# Altium schematic sheet PCB加热台3.0 copy_2022-02-18.schdoc
size 604 x 430 mm
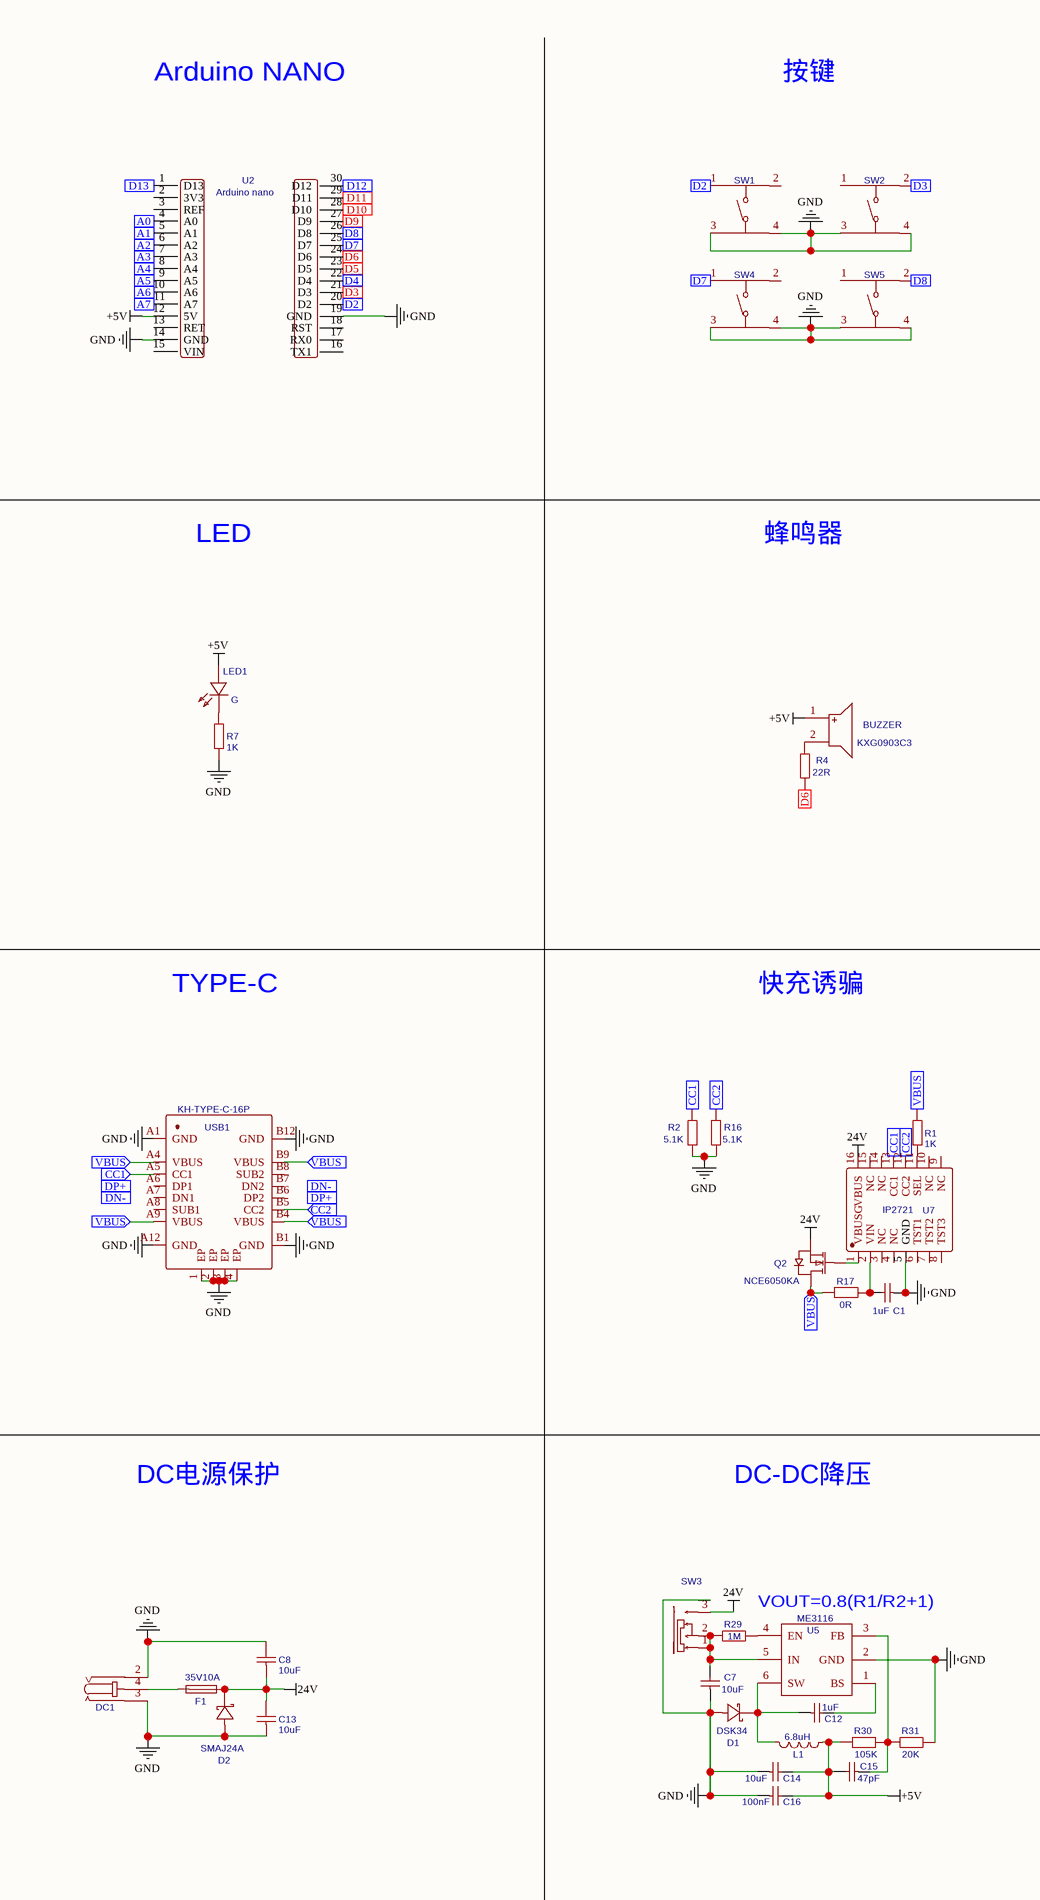
[diagram p0: PCB加热台3.0 copy_2022-02-18.schdoc, left]
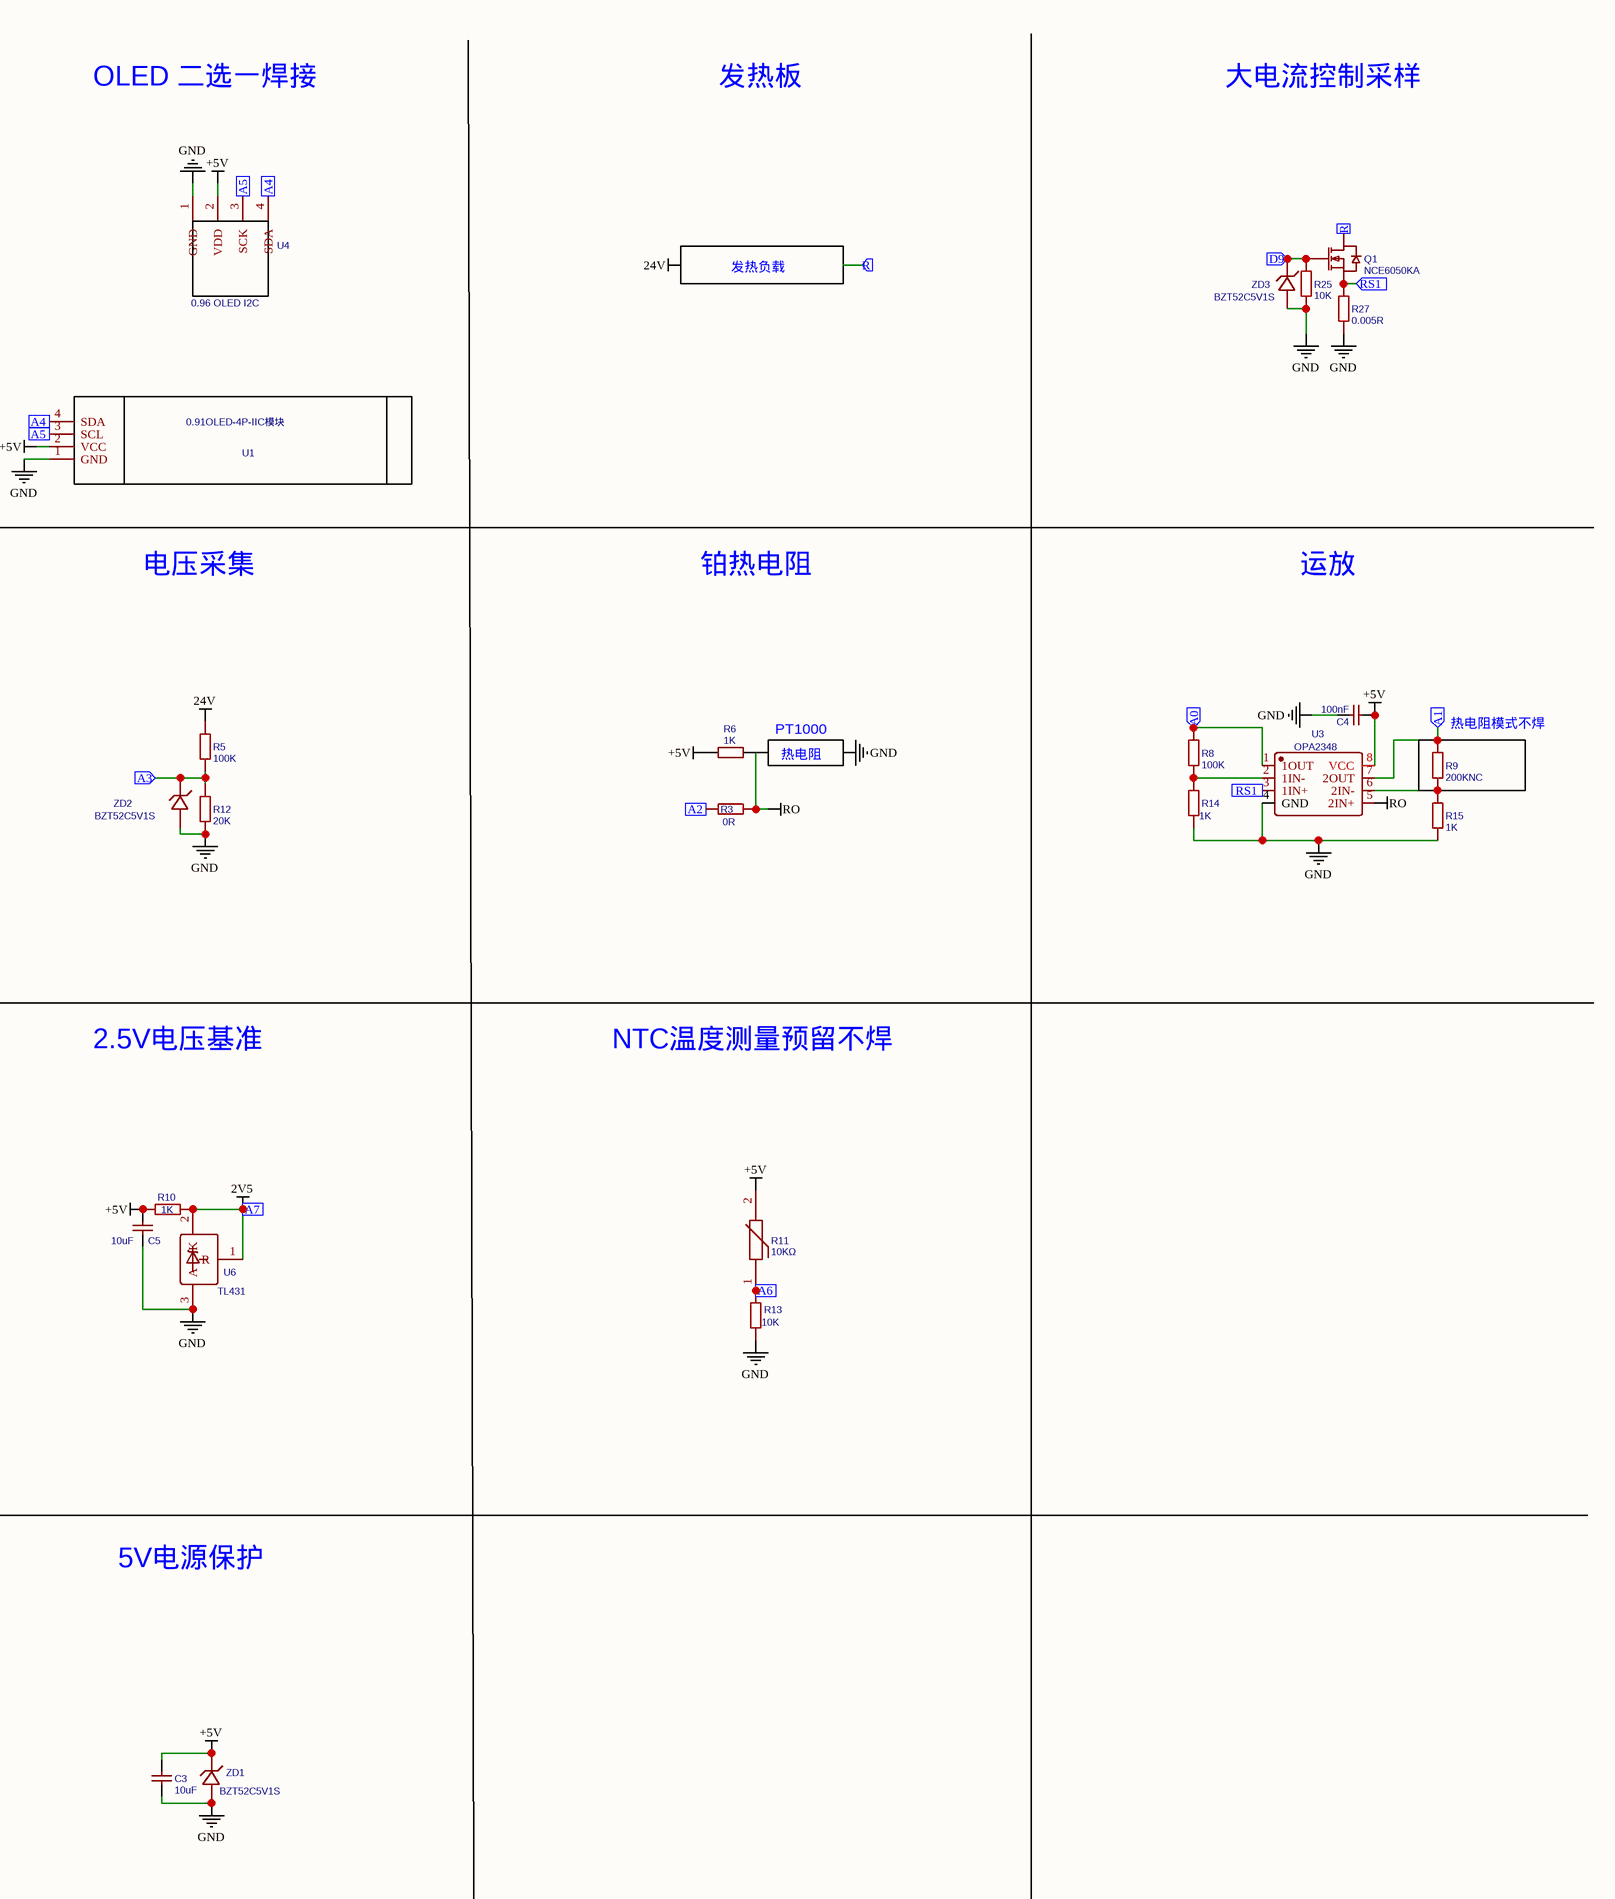
[diagram p1: PCB加热台3.0 copy_2022-02-18.schdoc, right]

## Parts
BUZZER  KXG0903C3  [BUZ-TH_BD9.6-P5.00-D0.7-FD]
C1  1uF  [C0603]
C3  10uF  [C0603]
C4  100nF  [C0603]
C5  10uF  [C0603]
C7  10uF  [C0603]
C8  10uF  [C1206]
C12  1uF  [C0603]
C13  10uF  [C1206]
C14  10uF  [C0603]
C15  47pF  [C0603]
C16  100nF  [C0603]
D1  DSK34  [SOD-123_L2.8-W1.8-LS3.7-RD]
D2  SMAJ24A  [SMA_L4.4-W2.8-LS5.4-R-RD]
DC1  DC-042C-W-2.0  [DC-IN-TH_DC-042C-W-2.0]  (value not drawn)
F1  35V10A  [F1206]
L1  6.8uH  [IND-SMD_L7.1-W6.6_YXMAA0603]
LED1  G  [LED0603-R-RD]
Q1  NCE6050KA  [TO-252-2_L6.6-W6.1-P4.57-LS9.9-TL-CW]
Q2  NCE6050KA  [TO-252-2_L6.6-W6.1-P4.57-LS9.9-TL-CW]
R1  1K  [R0603]
R2  5.1K  [R0603]
R3  0R  [R0603]
R4  22R  [R0603]
R5  100K  [R0603]
R6  1K  [R0805]
R7  1K  [R0603]
R8  100K  [R0603]
R9  200KNC  [R0603]
R10  1K  [R0603]
R11  10KΩ  [R0603]
R12  20K  [R0603]
R13  10K  [R0603]
R14  1K  [R0603]
R15  1K  [R0603]
R16  5.1K  [R0603]
R17  0R  [R0603]
R25  10K  [R0603]
R27  0.005R  [R1206]
R29  1M  [R0603]
R30  105K  [R0603]
R31  20K  [R0603]
SW1  PTS645SM43SMTR92LFS  [KEY-SMD_4P-L6.0-W6.0-P4.50-LS9.0]  (value not drawn)
SW2  PTS645SM43SMTR92LFS  [KEY-SMD_4P-L6.0-W6.0-P4.50-LS9.0]  (value not drawn)
SW3  MSS3-Q-T/R  [SW-SMD_MSS3-Q-T-R]  (value not drawn)
SW4  PTS645SM43SMTR92LFS  [KEY-SMD_4P-L6.0-W6.0-P4.50-LS9.0]  (value not drawn)
SW5  PTS645SM43SMTR92LFS  [KEY-SMD_4P-L6.0-W6.0-P4.50-LS9.0]  (value not drawn)
U1  0.91OLED-4P-IIC模块  [OLED-0.91-2.54*4P-IIC]
U2  Arduino nano  [ARDUINO NANO]
U3  OPA2348  [SOP-8_L5.0-W4.0-P1.27-LS6.0-BL]
U4  0.96 OLED I2C  [0.96 OLED I2C]
U5  ME3116  [SOT-23-6_L2.9-W1.6-P0.95-LS2.8-BR]
U6  TL431  [SOT-23-3_L2.9-W1.6-P1.90-LS2.8-BR]
U7  IP2721  [TSSOP-16_L5.0-W4.4-P0.65-LS6.4-BL]
USB1  KH-TYPE-C-16P  [USB-C-SMD_KH-TYPE-C-16P]
ZD1  BZT52C5V1S  [SOD-323_L1.8-W1.3-LS2.5-RD]
ZD2  BZT52C5V1S  [SOD-323_L1.8-W1.3-LS2.5-RD]
ZD3  BZT52C5V1S  [SOD-323_L1.8-W1.3-LS2.5-RD]

## Blocks framed on the sheet
热电阻模式不焊: R9

## Ports
A0 (in), A1 (in), A2 (in), A3 (in), A4 (in), A5 (in), A6 (in), A7 (in), CC1 (in), CC2 (in), D2 (in), D3 (in), D4 (in), D5 (in), D6 (in), D7 (in), D8 (in), D9 (in), D10 (in), D11 (in), D12 (in), D13 (in), DN- (in), DP+ (in), R (in), RS1 (in), VBUS (in)

## Nets
2V5: R10.1 U2.11(A7) U6.1(R) U6.2(K) ; port A7
24V: C8.1 C13.2 D2.2(K) F1.2 Q2.3(S) R5.2 SW3.3 U7.16(VBUS)
+5V: BUZZER.1 C3.2 C4.2 C5.2 C14.2 C15.2 C16.2 L1.1 LED1.1(A) R6.1 R10.2 R11.2 R30.2 U1.2(VCC) U2.12(5V) U3.8(VCC) U4.2(VDD) ZD1.1(K)
GND: C1.1 C3.1 C4.1 C5.1 C7.1 C8.2 C13.1 C14.1 C16.1 D1.2(A) D2.1(A) DC1.2 DC1.3 R2.2 R7.1 R12.1 R13.2 R14.2 R15.2 R16.2 R25.2 R27.1 R31.1 SW1.3 SW1.4 SW2.3 SW2.4 SW3.0 SW4.3 SW4.4 SW5.3 SW5.4 U1.1(GND) U2.14(GND) U2.19(GND) U3.4(GND) U4.1(GND) U5.2(GND) U6.3(A) U7.5(GND) USB1.1(EP) USB1.2(EP) USB1.3(EP) USB1.4(EP) USB1.A1(GND) USB1.A12(GND) USB1.B1(GND) USB1.B12(GND) ZD1.2(A) ZD2.2(A) ZD3.2(A)
RO: R3.2 R6.2 U3.5(2IN+)
A0: R8.1 U2.4(A0) U3.1(1OUT) ; port A0
A1: R9.1 U2.5(A1) U3.7(2OUT) ; port A1
A2: R3.1 U2.6(A2) ; port A2
A3: R5.1 R12.2 U2.7(A3) ZD2.1(K) ; port A3
A4: U1.4(SDA) U2.8(A4) U4.4(SDA) ; port A4
A5: U1.3(SCL) U2.9(A5) U4.3(SCK) ; port A5
A6: R11.1 R13.1 U2.10(A6) ; port A6
CC1: R2.1 U7.13(CC1) USB1.A5(CC1) ; port CC1
CC2: R16.1 U7.12(CC2) USB1.B5(CC2) ; port CC2
D2: SW1.1 U2.20(D2) ; port D2
D3: SW2.2 U2.21(D3) ; port D3
D4: U2.22(D4) ; port D4
D5: U2.23(D5) ; port D5
D6: R4.1 U2.24(D6) ; port D6
D7: SW4.1 U2.25(D7) ; port D7
D8: SW5.2 U2.26(D8) ; port D8
D9: Q1.1(G) R25.1 U2.27(D9) ZD3.1(K) ; port D9
D10: U2.28(D10) ; port D10
D11: U2.29(D11) ; port D11
D12: U2.30(D12) ; port D12
D13: U2.1(D13) ; port D13
R: Q1.2(D) ; port R
RS1: Q1.3(S) R27.2 U3.3(1IN+) ; port RS1
VBUS: Q2.2(D) R1.1 R17.1 USB1.A4(VBUS) USB1.A9(VBUS) USB1.B4(VBUS) USB1.B9(VBUS) ; port VBUS
NetBUZZER_2: BUZZER.2 R4.2
NetC1_2: C1.2 R17.2 U7.2(VIN)
NetC7_2: C7.2 R29.1 SW3.1 SW3.2 U5.5(IN)
NetC12_1: C12.1 D1.1(K) L1.2 U5.6(SW)
NetC12_2: C12.2 U5.1(BS)
NetC15_1: C15.1 R30.1 R31.2 U5.3(FB)
NetDC1_4: DC1.4 F1.1
NetLED1_2: LED1.2(K) R7.2
NetQ2_1: Q2.1(G) U7.1(VBUSG)
NetR1_2: R1.2 U7.11(SEL)
NetR8_2: R8.2 R14.1 U3.2(1IN-)
NetR9_2: R9.2 R15.1 U3.6(2IN-)
NetR29_2: R29.2 U5.4(EN)

Not connected (* = marked no-connect by the designer): SW1 2; SW2 1; SW4 2; SW5 1; U2 2(3V3) 3(REF) 13(RET) 15(VIN) 16(TX1) 17(RX0) 18(RST); U7 3(NC) 4(NC) 6(TST1) 7(TST2) 8(TST3) 9(NC) 10(NC) 14(NC) 15(NC); USB1 A6(DP1) A7(DN1) A8(SUB1) B6(DP2) B7(DN2) B8(SUB2)

## Notes on the sheet
- Arduino NANO
- 按键
- OLED 二选一焊接
- 发热板
- 大电流控制采样
- 发热负载
- LED
- 蜂鸣器
- 电压采集
- 铂热电阻
- 运放
- (near R6) PT1000
- 热电阻
- TYPE-C
- 快充诱骗
- 2.5V电压基准
- NTC温度测量预留不焊
- DC电源保护
- DC-DC降压
- 5V电源保护
- VOUT=0.8(R1/R2+1)
- Labels drawn without touching a wire or pin: 24V, GND

## Library data of the parts
BUZZER = KXG0903C3: BOM_Manufacturer: 志丰电子(KINGSTATE); Contributor: LCSC; BOM_Supplier: LCSC; BOM_Supplier Part: C1122357; BOM_Manufacturer Part: KXG0903C3; BOM_JLCPCB Part Class: Extended Part; spicePre: B; spiceSymbolName: KXG0903C3
C1 C12 = 1uF: BOM_Manufacturer: FH; BOM_Manufacturer Part: 0603F105M160NT; nameAlias: Capacitance; BOM_Supplier: LCSC; BOM_Supplier Part: C1689; spicePre: C; spiceSymbolName: 0603F105M160NT
C3 C5 C7 C14 = 10uF: BOM_Manufacturer: FH; BOM_Manufacturer Part: 0603F105M160NT; nameAlias: Capacitance; BOM_Supplier: LCSC; BOM_Supplier Part: C1689; spicePre: C; spiceSymbolName: 0603F105M160NT
C4 C16 = 100nF: BOM_Manufacturer: FH; BOM_Manufacturer Part: 0603F105M160NT; nameAlias: Capacitance; BOM_Supplier: LCSC; BOM_Supplier Part: C1689; spicePre: C; spiceSymbolName: 0603F105M160NT
C8 C13 = 10uF: BOM_Manufacturer: TDK; BOM_Manufacturer Part: C3216X5R1H106KT000N; nameAlias: Capacitance; Contributor: LCSC; BOM_Supplier: LCSC; BOM_Supplier Part: C329928; spicePre: C; spiceSymbolName: C3216X5R1H106KT000N
C15 = 47pF: BOM_Manufacturer: FH; BOM_Manufacturer Part: 0603F105M160NT; nameAlias: Capacitance; BOM_Supplier: LCSC; BOM_Supplier Part: C1689; spicePre: C; spiceSymbolName: 0603F105M160NT
D1 = DSK34: BOM_Manufacturer: FUXINSEMI; Contributor: LCSC; BOM_Supplier: LCSC; BOM_Supplier Part: C908230; BOM_Manufacturer Part: DSK34; spicePre: D; spiceSymbolName: DSK34_C908230
D2 = SMAJ24A: BOM_Manufacturer: TWGMC; Contributor: LCSC; BOM_Supplier: LCSC; BOM_Supplier Part: C726750; BOM_Manufacturer Part: SMAJ24A; spicePre: D; spiceSymbolName: SMAJ24A_C726750
DC1 = DC-042C-W-2.0: BOM_Manufacturer: XKB Enterprise; Contributor: LCSC; BOM_Supplier: LCSC; BOM_Supplier Part: C381108; BOM_Manufacturer Part: DC-042C-W-2.0; spicePre: D; spiceSymbolName: DC-042C-W-2.0
F1 = 35V10A: BOM_Manufacturer: TA-I Tech; BOM_Manufacturer Part: CFS12V3T7R0; Contributor: LCSC; BOM_Supplier: LCSC; BOM_Supplier Part: C163124; spicePre: F; spiceSymbolName: CFS12V3T7R0
L1 = 6.8uH: BOM_Manufacturer: TAITEC; BOM_Manufacturer Part: TMPA0603S-6R8MN-D; nameAlias: Inductance; Contributor: LCSC; BOM_Supplier: LCSC; BOM_Supplier Part: C357102; spicePre: L; spiceSymbolName: TMPA0603S-6R8MN-D
LED1 = G: BOM_Manufacturer: Orient; BOM_Manufacturer Part: ORH-G36G; Contributor: LCSC; SMT Type: Extend; BOM_Supplier: LCSC; BOM_Supplier Part: C205443; BOM_LCSC Assembly: Yes; spicePre: L; spiceSymbolName: ORH-G36G
Q1 Q2 = NCE6050KA: BOM_Manufacturer: Ncepower; BOM_Supplier: LCSC; BOM_Manufacturer Part: NCE6050KA; BOM_Supplier Part: C96013; BOM_JLCPCB Part Class: Extended Part; spicePre: Q; spiceSymbolName: NCE6050KA
R1 R7 R10 R14 R15 = 1K: BOM_Manufacturer: SANYEAR; BOM_Manufacturer Part: SY0603JN1KP; nameAlias: Resistance (Ohms); Contributor: LCSC; BOM_Supplier: LCSC; BOM_Supplier Part: C380759; spicePre: R; spiceSymbolName: SY0603JN1KP
R2 R16 = 5.1K: BOM_Manufacturer: SANYEAR; BOM_Manufacturer Part: SY0603JN1KP; nameAlias: Resistance (Ohms); Contributor: LCSC; BOM_Supplier: LCSC; BOM_Supplier Part: C380759; spicePre: R; spiceSymbolName: SY0603JN1KP
R3 R17 = 0R: BOM_Manufacturer: SANYEAR; BOM_Manufacturer Part: SY0603JN1KP; nameAlias: Resistance (Ohms); Contributor: LCSC; BOM_Supplier: LCSC; BOM_Supplier Part: C380759; spicePre: R; spiceSymbolName: SY0603JN1KP
R4 = 22R: BOM_Manufacturer: SANYEAR; BOM_Manufacturer Part: SY0603JN1KP; nameAlias: Resistance (Ohms); Contributor: LCSC; BOM_Supplier: LCSC; BOM_Supplier Part: C380759; spicePre: R; spiceSymbolName: SY0603JN1KP
R5 R8 = 100K: BOM_Manufacturer: SANYEAR; BOM_Manufacturer Part: SY0603JN1KP; nameAlias: Resistance (Ohms); Contributor: LCSC; BOM_Supplier: LCSC; BOM_Supplier Part: C380759; spicePre: R; spiceSymbolName: SY0603JN1KP
R6 = 1K: BOM_Manufacturer: YAGEO; BOM_Manufacturer Part: RC0805FR-071KL; nameAlias: Resistance (Ohms); BOM_Supplier: LCSC; BOM_Supplier Part: C95781; spicePre: R; spiceSymbolName: RC0805FR-071KL
R9 = 200KNC: BOM_Manufacturer: SANYEAR; BOM_Manufacturer Part: SY0603JN1KP; nameAlias: Resistance (Ohms); Contributor: LCSC; BOM_Supplier: LCSC; BOM_Supplier Part: C380759; spicePre: R; spiceSymbolName: SY0603JN1KP
R11 = 10KΩ: BOM_Manufacturer: VISHAY; BOM_Manufacturer Part: NTCS0603E3103FLT; nameAlias: Value; Contributor: LCSC; BOM_Supplier: LCSC; BOM_Supplier Part: C142556; BOM_JLCPCB Part Class: Extended Part; spicePre: R; spiceSymbolName: NTCS0603E3103FLT
R12 R31 = 20K: BOM_Manufacturer: SANYEAR; BOM_Manufacturer Part: SY0603JN1KP; nameAlias: Resistance (Ohms); Contributor: LCSC; BOM_Supplier: LCSC; BOM_Supplier Part: C380759; spicePre: R; spiceSymbolName: SY0603JN1KP
R13 R25 = 10K: BOM_Manufacturer: SANYEAR; BOM_Manufacturer Part: SY0603JN1KP; nameAlias: Resistance (Ohms); Contributor: LCSC; BOM_Supplier: LCSC; BOM_Supplier Part: C380759; spicePre: R; spiceSymbolName: SY0603JN1KP
R27 = 0.005R: BOM_Manufacturer: YAGEO; BOM_Manufacturer Part: RL1206FR-070R01L; nameAlias: Resistance (Ohms); Contributor: LCSC; SMT Type: Extend; BOM_Supplier: LCSC; BOM_Supplier Part: C309628; BOM_JLCPCB SMD: Yes; spicePre: R; spiceSymbolName: RL1206FR-070R01L
R29 = 1M: BOM_Manufacturer: SANYEAR; BOM_Manufacturer Part: SY0603JN1KP; nameAlias: Resistance (Ohms); Contributor: LCSC; BOM_Supplier: LCSC; BOM_Supplier Part: C380759; spicePre: R; spiceSymbolName: SY0603JN1KP
R30 = 105K: BOM_Manufacturer: SANYEAR; BOM_Manufacturer Part: SY0603JN1KP; nameAlias: Resistance (Ohms); Contributor: LCSC; BOM_Supplier: LCSC; BOM_Supplier Part: C380759; spicePre: R; spiceSymbolName: SY0603JN1KP
SW1 SW2 SW4 SW5 = PTS645SM43SMTR92LFS: BOM_Manufacturer: C&K; Contributor: LCSC; BOM_Supplier: LCSC; BOM_Supplier Part: C221880; BOM_Manufacturer Part: PTS645SM43SMTR92LFS; BOM_JLCPCB Part Class: Extended Part; spicePre: S; spiceSymbolName: PTS645SM43SMTR92LFS
SW3 = MSS3-Q-T/R: BOM_Manufacturer: Diptronics; Contributor: LCSC; BOM_Supplier: LCSC; BOM_Supplier Part: C240299; BOM_Manufacturer Part: MSS3-Q-T/R; spicePre: S; spiceSymbolName: MSS3-Q-T/R
U1 = 0.91OLED-4P-IIC模块: Contributor: youngfar; spicePre: U; spiceSymbolName: 0.91OLED-4P-IIC模块
U2 = Arduino nano: Contributor: FJ956391150; spicePre: U; spiceSymbolName: Arduino nano
U3 = OPA2348: BOM_Manufacturer: IDCHIP; BOM_Manufacturer Part: LM358; Contributor: LCSC; BOM_Supplier: LCSC; BOM_Supplier Part: C329455; spicePre: U; spiceSymbolName: LM358_C329455
U4 = 0.96 OLED I2C: Contributor: FJ956391150; spicePre: U; spiceSymbolName: 0.96 OLED I2C
U5 = ME3116: BOM_Manufacturer: MICRONE; BOM_Paste Type: recommend; BOM_Assembly Type: smtWeld; BOM_Supplier: LCSC; BOM_Manufacturer Part: ME3116; BOM_Supplier Part: C97643; spicePre: U; spiceSymbolName: ME3116
U6 = TL431: BOM_Manufacturer: JSMSEMI; Contributor: LCSC; BOM_Supplier: LCSC; BOM_Supplier Part: C963380; BOM_Manufacturer Part: TL431; spicePre: U; spiceSymbolName: TL431_C963380
U7 = IP2721: BOM_Manufacturer: INJOINIC; Contributor: LCSC; BOM_Supplier: LCSC; BOM_Supplier Part: C603176; BOM_Manufacturer Part: IP2721; BOM_JLCPCB Part Class: Extended Part; spicePre: U; spiceSymbolName: IP2721
USB1 = KH-TYPE-C-16P: BOM_Manufacturer: Shenzhen Kinghelm Elec; Contributor: LCSC; BOM_Supplier: LCSC; BOM_Supplier Part: C709357; BOM_Manufacturer Part: KH-TYPE-C-16P; spicePre: U; spiceSymbolName: KH-TYPE-C-16P
ZD1-ZD3 = BZT52C5V1S: BOM_Manufacturer: CJ; BOM_Paste Type: expand; BOM_Supplier: LCSC; BOM_Manufacturer Part: BZT52C5V1S; image: //image.lceda.cn/szlcsc/C2118.jpg; BOM_Supplier Part: C2118; spicePre: Z; spiceSymbolName: BZT52C5V1S